# EAGLE schematic htsenti (EAGLE 9.6.2)
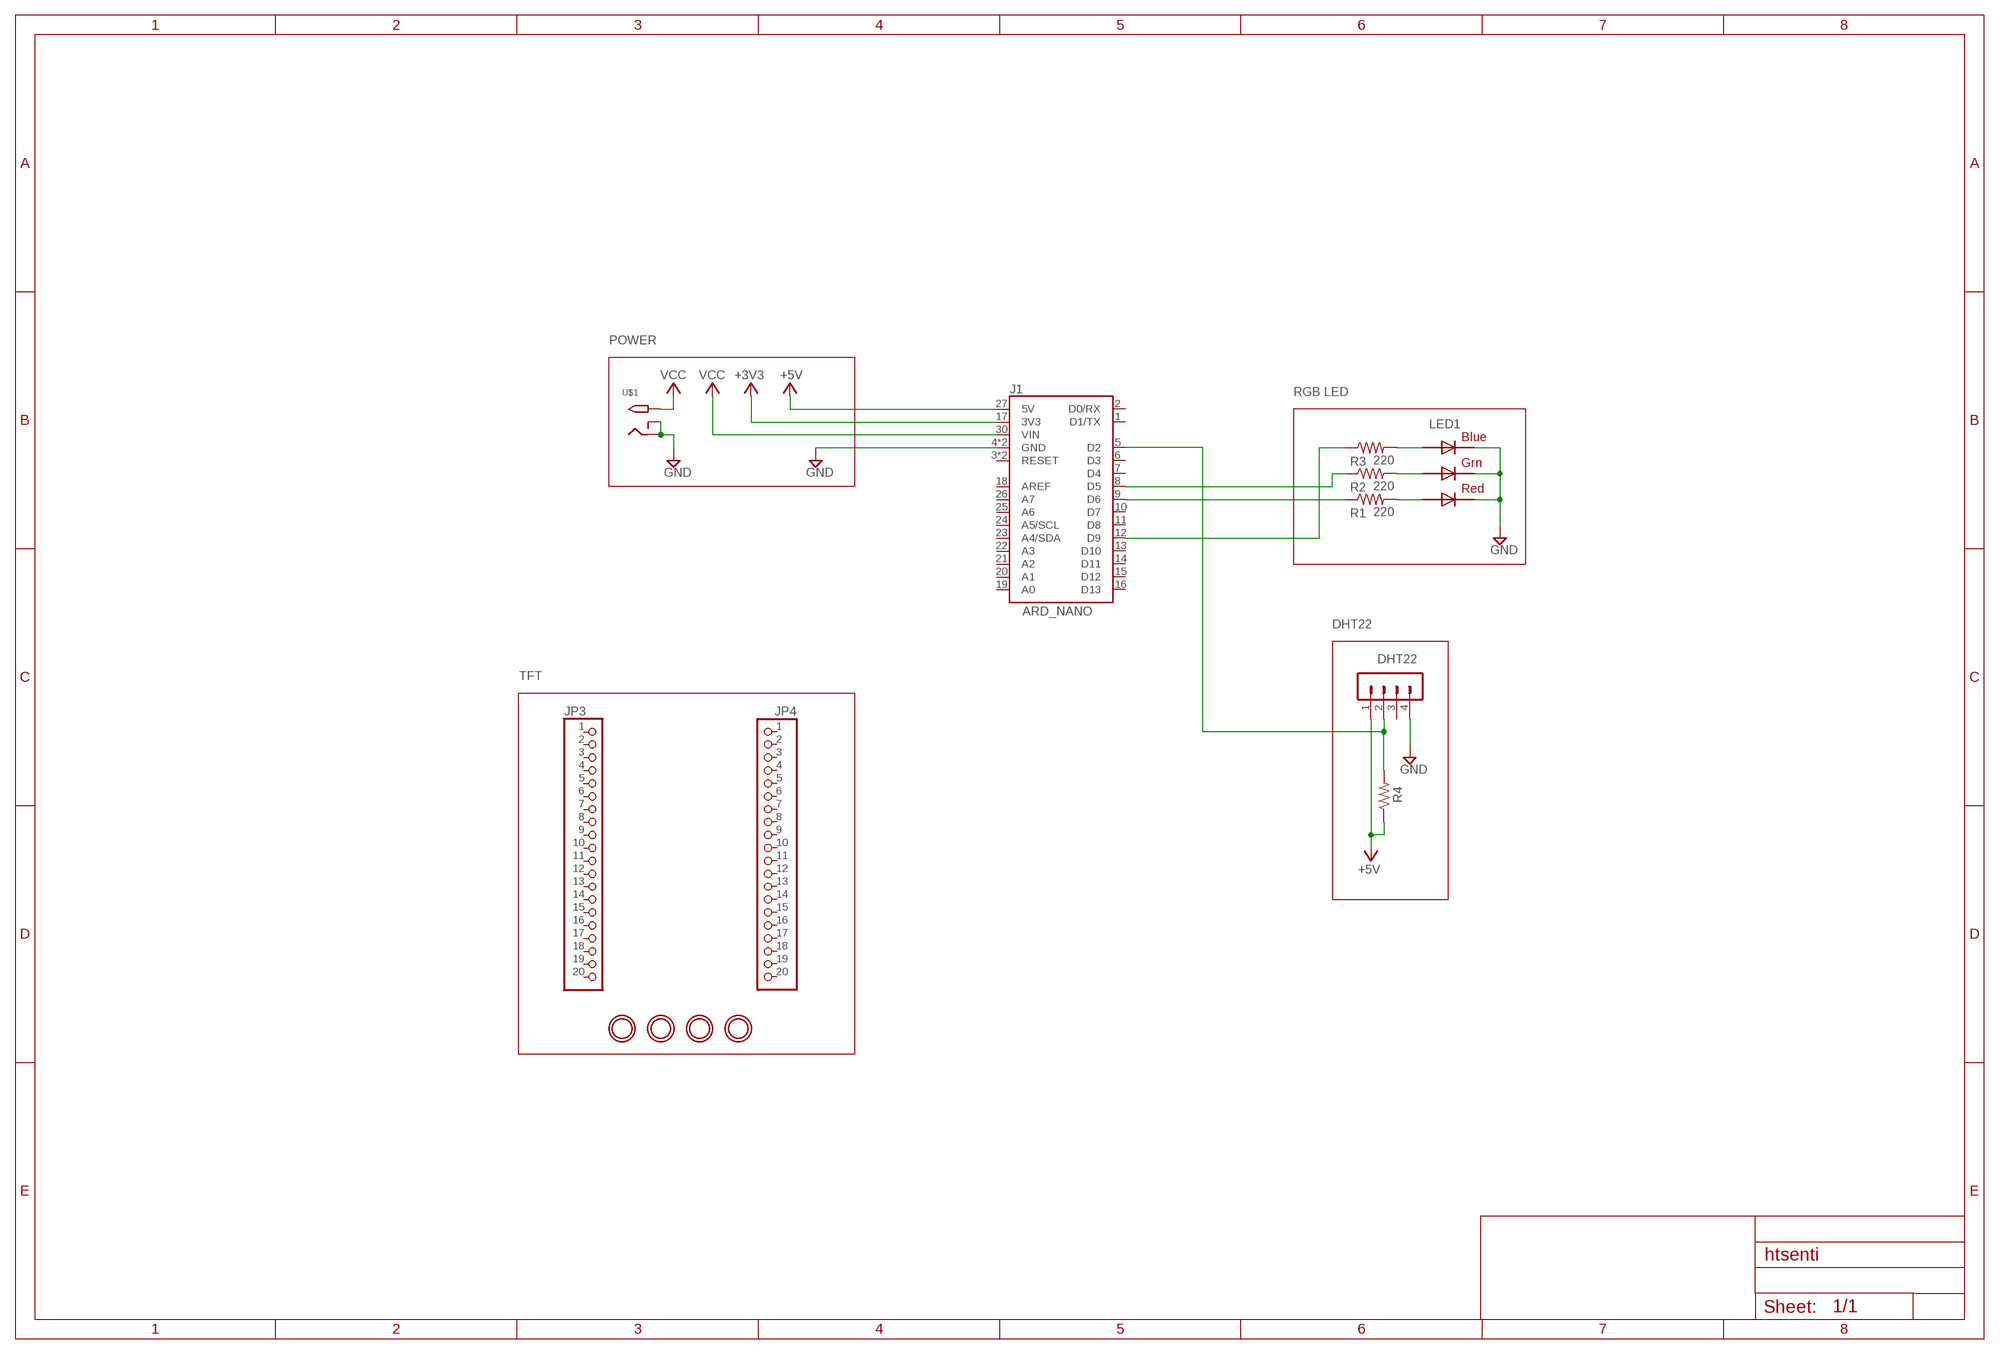
[diagram p0: schematic, sheet 1]

## Parts
DHT22  MA04-1  [MA04-1]
J1  NANO_FOOTPRINT  [NANO]
JP3  HEADER-1X20ROUND  [1X20_ROUND]
JP4  HEADER-1X20ROUND  [1X20_ROUND]
LED1  RGBLED5050  [RGBLED5050]
R1  220  220OHM-0603-1/10W-1%  [0603]
R2  220  220OHM-0603-1/10W-1%  [0603]
R3  220  220OHM-0603-1/10W-1%  [0603]
R4  R-US_M0805  [M0805]
U$1  2.1MMJACKSMT  [DCJACK_2MM_SMT]
U$2  MOUNTINGHOLE3.0THIN  [MOUNTINGHOLE_3.0_PLATEDTHIN]
U$3  MOUNTINGHOLE3.0THIN  [MOUNTINGHOLE_3.0_PLATEDTHIN]
U$4  MOUNTINGHOLE3.0THIN  [MOUNTINGHOLE_3.0_PLATEDTHIN]
U$5  MOUNTINGHOLE3.0THIN  [MOUNTINGHOLE_3.0_PLATEDTHIN]

## Nets
+3V3: J1.17(3V3)
+5V: DHT22.1 J1.27(5V) R4.1
GND: DHT22.4 J1.4(GND) J1.29(GND) LED1.4(BLUE_C) LED1.5(RED_C) LED1.6(GREEN_C) U$1.GND(RING) U$1.GNDBREAK(RING_SW)
N$1: LED1.2(RED_A) R1.2
N$2: LED1.1(GREEN_A) R2.2
N$3: LED1.3(BLUE_A) R3.2
N$4: J1.9(D6) R1.1
N$5: J1.8(D5) R2.1
N$6: J1.12(D9) R3.1
N$7: DHT22.2 J1.5(D2) R4.2
VCC: J1.30(VIN) U$1.PWR2(TIP)
Unconnected: DHT22.3 J1.1(D1/TX) J1.2(D0/RX) J1.3(RESET) J1.6(D3) J1.7(D4) J1.10(D7) J1.11(D8) J1.13(D10) J1.14(D11) J1.15(D12) J1.16(D13) J1.18(AREF) J1.19(A0) J1.20(A1) J1.21(A2) J1.22(A3) J1.23(A4/SDA) J1.24(A5/SCL) J1.25(A6) J1.26(A7) J1.28(RESET) JP3.1 JP3.2 JP3.3 JP3.4 JP3.5 JP3.6 JP3.7 JP3.8 JP3.9 JP3.10 JP3.11 JP3.12 JP3.13 JP3.14 JP3.15 JP3.16 JP3.17 JP3.18 JP3.19 JP3.20 JP4.1 JP4.2 JP4.3 JP4.4 JP4.5 JP4.6 JP4.7 JP4.8 JP4.9 JP4.10 JP4.11 JP4.12 JP4.13 JP4.14 JP4.15 JP4.16 JP4.17 JP4.18 JP4.19 JP4.20

## Notes on the sheet
- POWER
- RGB LED
- ARD_NANO
- DHT22
- TFT

## Library data of the parts
DHT22 = con-lstb:MA04-1: PIN HEADER; OC_FARNELL: unknown; OC_NEWARK: unknown
J1 = SparkFun-Boards:NANO_FOOTPRINT: Generic Nano Footprint
JP3 JP4 = microbuilder:HEADER-1X20
LED1 = adafruit:RGBLED: For 5050 RGB LEDs, the order of the LEDs may vary from one manufacturer to another!
R1-R3 = SparkFun-Resistors:220OHM: 220Ω resistor A resistor is a passive two-terminal electrical component that implements electrical resistance as a circuit element. Resistors act to reduce current flow, and, at the same time, act to lower voltage levels within circuits. - Wikipedia; PROD_ID: RES-07861
R4 = adafruit:R-US_: RESISTOR, American symbol
U$1 = adafruit:2.1MMJACK: 2.1mm x 5.5mm THM DC jack with internal switch. Digikey part #PJ-102A, 4UCON part #05537 2.1mm x 5.5mm SMT DC jack with internal switch. Digikey part #PJ-002A-SMT, 4UCON part #03267 By microbuilder.eu & adafruit.com
U$2-U$5 = microbuilder:MOUNTINGHOLE: Mounting Hole For #2 screws (0.086"/2.18mm width, 0.094"/2.4mm hole) use 2.5mm; BOM: EXCLUDE